# EAGLE board Mixed_signal_board (EAGLE 9.6.2), part 1 of 2
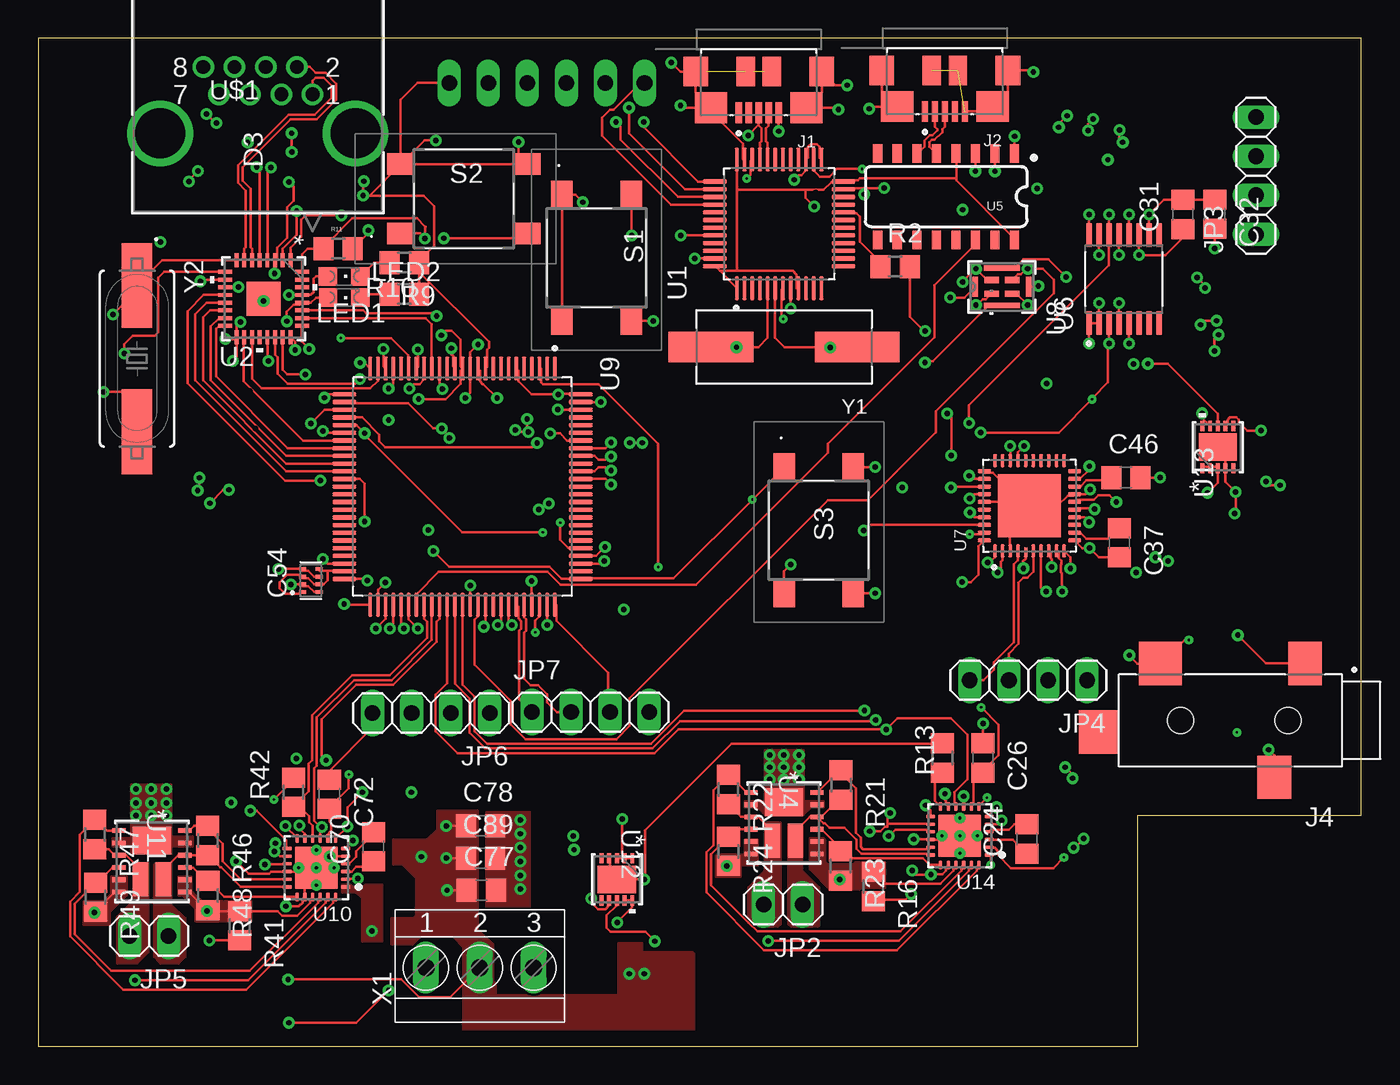
[diagram p7: board, top side]
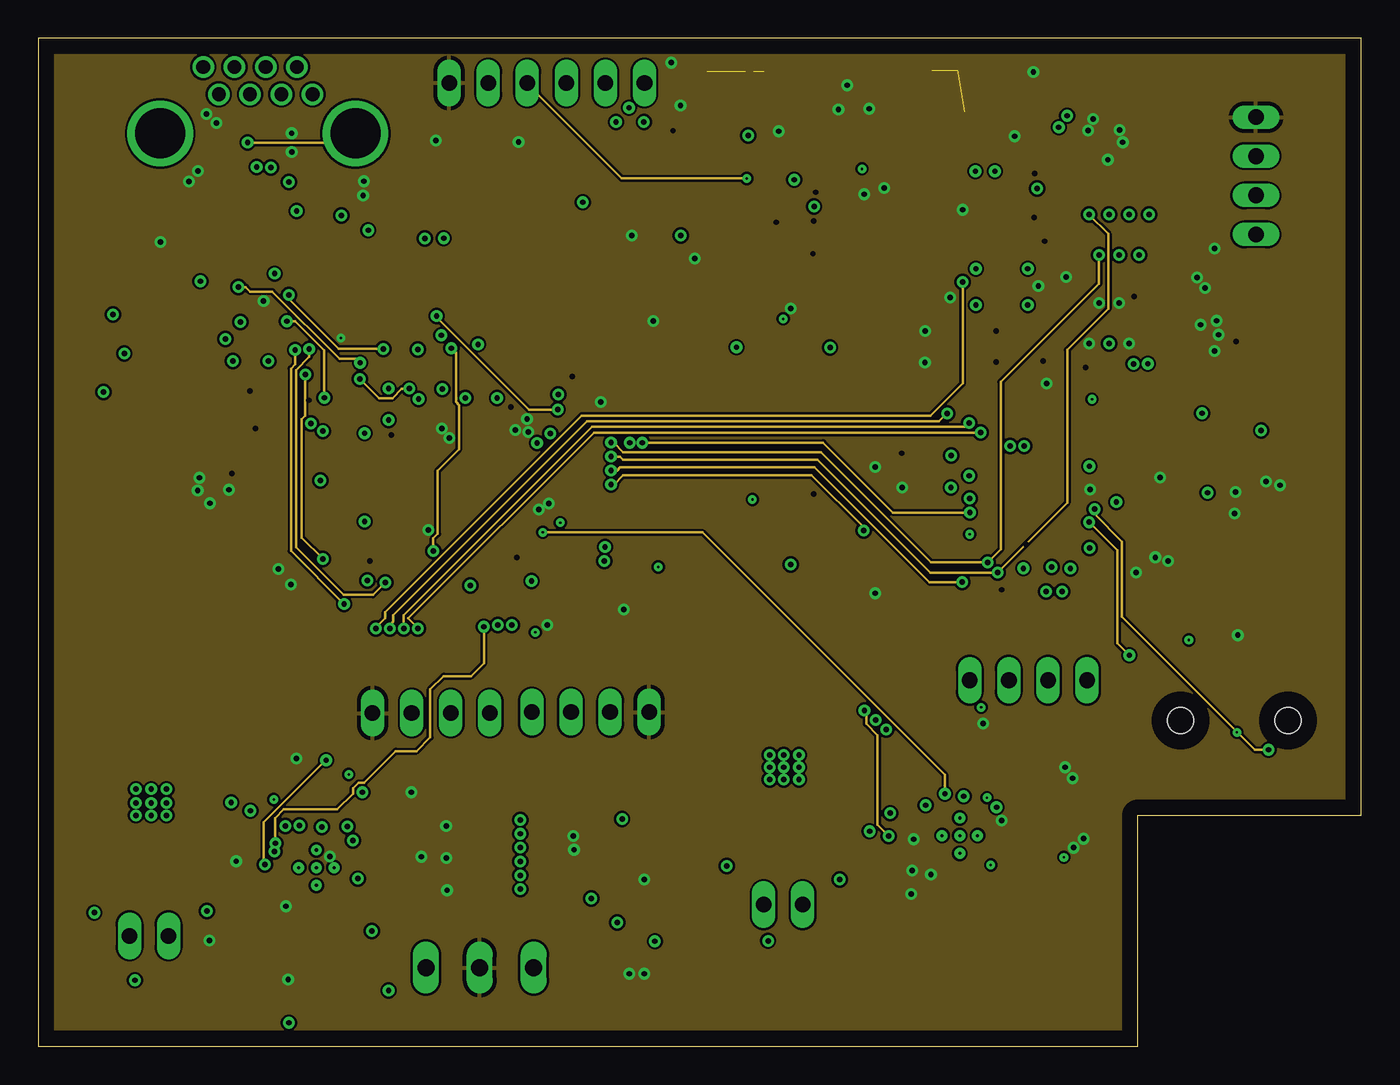
[diagram p8: board, inner layer Route2]
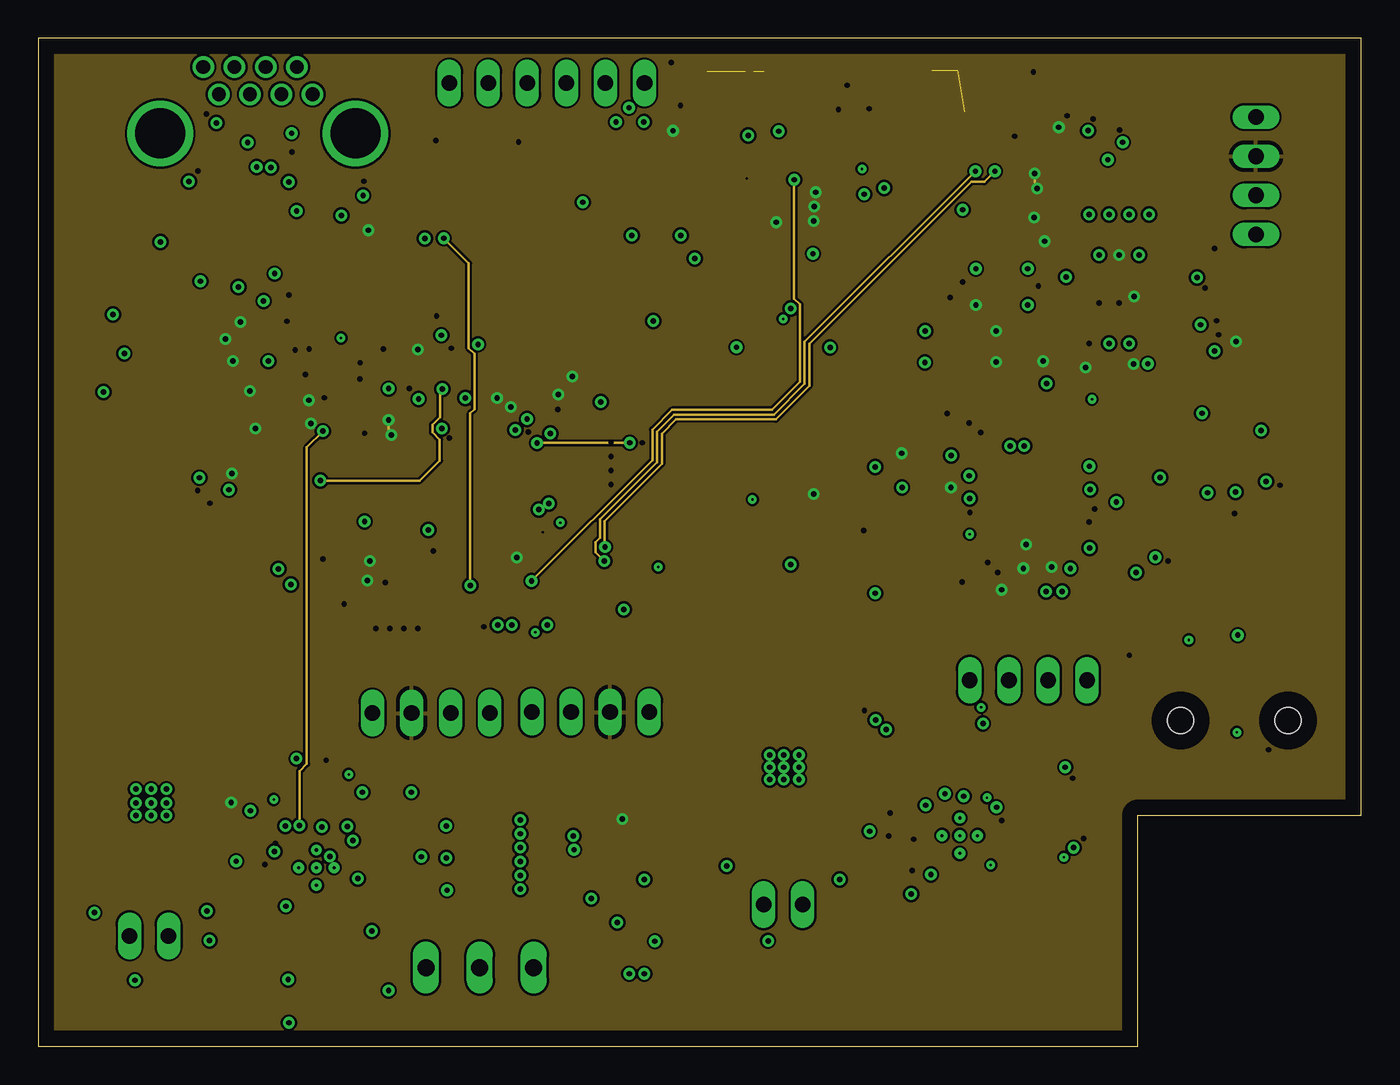
[diagram p9: board, inner layer Route15]
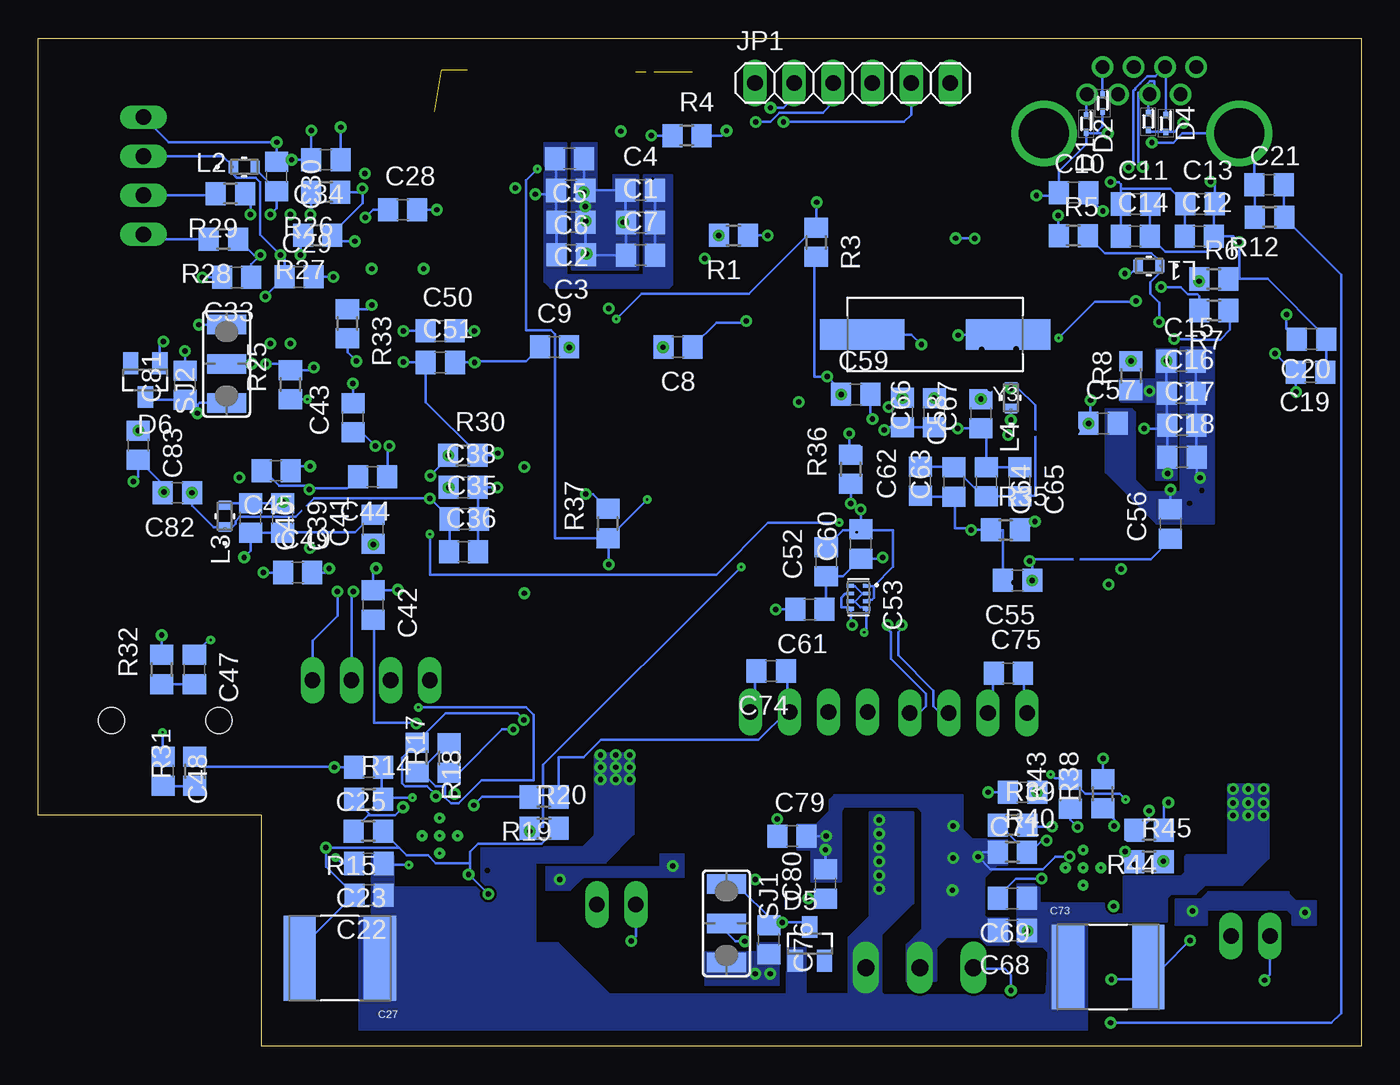
[diagram p10: board, bottom side, seen from below]

Size 86 x 65.5 mm. Coordinates in mm from the lower left corner, seen from the top.
Outline: 71.5,0 71.5,15 86,15 86,65.5 0,65.5 0,0 71.5,0
Copper layers ([2:[15:1+2*15+16]:15]): Top 0.035mm / dielectric 0.2mm / Route2 0.0175mm / dielectric 1.065mm / Route15 0.0175mm / dielectric 0.2mm / Bottom 0.035mm
Design rules "default *": minimum track width 6mil, minimum drill 0.008890625mm, track to track 6mil, track to pad 6mil, pad to pad 6mil, via to via 6mil, smd to smd 0.015240625mm, copper to edge 40mil, drill to drill 6mil, minimum pad ring 10mil, minimum via ring 8mil, stop-mask expansion 4mil, vias tented up to drill 0mil, thermal gap 10mil
Net classes: 1 50ohm: width 0.015 mm, drill 0.015 mm, clearance 0.127 mm

## Footprints (pad centres in the part's own frame; a part is rotated, then mirrored left to right if it is on the bottom)
C0805 = smd 1.3 x 1.5: 1 -0.95,0; 2 0.95,0
CAPC6153X670N = smd 2.09 x 5.52: 1 -2.607,0; 2 2.607,0
CAP_LLA219C70G225MA01L = smd 0.25 x 0.475: 1 -0.75,0.537; 2 -0.25,0.537; 3 0.25,0.537; 4 0.75,0.537; 5 0.75,-0.537; 6 0.25,-0.537; 7 -0.25,-0.537; 8 -0.75,-0.537
SODFL1006X43N = smd 0.43 x 0.32: 1 -0.55,0; 2 0.55,0
SOT23 = smd 1 x 1.4: 1 -0.95,-1.1; 2 0.95,-1.1; 3 0,1.1
HRS_ZX62R-B-5P(30) = smd 0.4 x 1.35: 1 1.3,2.675; 2 0.65,2.675; 3 0,2.675; 4 -0.65,2.675; 5 -1.3,2.675 | smd 2.1 x 2: S1 -3.1,2.35; S2 3.1,2.35 | smd 1.6 x 1.9: S3 4.1,0; S6 -4.1,0 | smd 1.2 x 1.9: S4 0.85,0; S5 -0.85,0
CUI_SJ-3524-SMT = smd 2.2 x 2.8: 1 -1.1,-3.7; 3 0.9,3.7 | smd 2.8 x 2.8: 2 8.3,-3.7 | smd 2.6 x 2.8: 4 12.3,0.75 | hole 1.7: 0,0; 7,0
1X06 = drill 1.016 long: 1 -6.35,0; 2 -3.81,0; 3 -1.27,0; 4 1.27,0; 5 3.81,0; 6 6.35,0
1X02 = drill 1.016 long: 1 -1.27,0; 2 1.27,0
1X04 = drill 1.016 long: 1 -3.81,0; 2 -1.27,0; 3 1.27,0; 4 3.81,0
IND_MPZ1608_TDK = smd 0.597 x 0.813: 1 -0.705,0; 2 0.705,0
CHIPLED_0805 = smd 1.2 x 1.2: A 0,-1.05; C 0,1.05
R0805 = smd 1.3 x 1.5: 1 -0.95,0; 2 0.95,0
TL3145AF180QJ = smd 1.8 x 1.4: 1 -4.1,-2.25; 2 4.1,-2.25; 3 -4.1,2.25; 4 4.1,2.25
SJ_2W = smd 1.27 x 2.54: 1 -2.54,0; 2 0,0; 3 2.54,0
QFP50P900X900X160-48N = smd 1.56 x 0.28: 1 -4.18,2.75; 2 -4.18,2.25; 3 -4.18,1.75; 4 -4.18,1.25; 5 -4.18,0.75; 6 -4.18,0.25; 7 -4.18,-0.25; 8 -4.18,-0.75; 9 -4.18,-1.25; 10 -4.18,-1.75; 11 -4.18,-2.25; 12 -4.18,-2.75; 25 4.18,-2.75; 26 4.18,-2.25; 27 4.18,-1.75; 28 4.18,-1.25; 29 4.18,-0.75; 30 4.18,-0.25; 31 4.18,0.25; 32 4.18,0.75; 33 4.18,1.25; 34 4.18,1.75; 35 4.18,2.25; 36 4.18,2.75 | smd 0.28 x 1.56: 13 -2.75,-4.18; 14 -2.25,-4.18; 15 -1.75,-4.18; 16 -1.25,-4.18; 17 -0.75,-4.18; 18 -0.25,-4.18; 19 0.25,-4.18; 20 0.75,-4.18; 21 1.25,-4.18; 22 1.75,-4.18; 23 2.25,-4.18; 24 2.75,-4.18; 37 2.75,4.18; 38 2.25,4.18; 39 1.75,4.18; 40 1.25,4.18; 41 0.75,4.18; 42 0.25,4.18; 43 -0.25,4.18; 44 -0.75,4.18; 45 -1.25,4.18; 46 -1.75,4.18; 47 -2.25,4.18; 48 -2.75,4.18
VQFN32_RHB_TEX-M = smd 0.908 x 0.255: 1 -2.499,1.75; 2 -2.499,1.25; 3 -2.499,0.75; 4 -2.499,0.25; 5 -2.499,-0.25; 6 -2.499,-0.75; 7 -2.499,-1.25; 8 -2.499,-1.75; 17 2.499,-1.75; 18 2.499,-1.25; 19 2.499,-0.75; 20 2.499,-0.25; 21 2.499,0.25; 22 2.499,0.75; 23 2.499,1.25; 24 2.499,1.75 | smd 0.255 x 0.908: 9 -1.75,-2.499; 10 -1.25,-2.499; 11 -0.75,-2.499; 12 -0.25,-2.499; 13 0.25,-2.499; 14 0.75,-2.499; 15 1.25,-2.499; 16 1.75,-2.499; 25 1.75,2.499; 26 1.25,2.499; 27 0.75,2.499; 28 0.25,2.499; 29 -0.25,2.499; 30 -0.75,2.499; 31 -1.25,2.499; 32 -1.75,2.499 | smd 2.21 x 2.21: 33 0,0
QFN_LFJ-13_DIO = smd 0.305 x 0.864: 1 -2,2.146; 2 -1.2,2.146; 3 -0.4,2.146; 4 0.4,2.146; 5 1.2,2.146; 6 2,2.146; 7 2,-2.146; 8 1.2,-2.146; 9 0.4,-2.146; 10 -0.4,-2.146; 11 -1.2,-2.146; 12 -2,-2.146 | smd 2.21 x 1: 13 1.151,-0.75; 15 1.151,0.75 | smd 1.803 x 2.5: 14 -1.355,0
SO016 = smd 0.6 x 1.2: 1 -4.445,-2.8; 2 -3.175,-2.8; 3 -1.905,-2.8; 4 -0.635,-2.8; 5 0.635,-2.8; 6 1.905,-2.8; 7 3.175,-2.8; 8 4.445,-2.8; 9 4.445,2.8; 10 3.175,2.8; 11 1.905,2.8; 12 0.635,2.8; 13 -0.635,2.8; 14 -1.905,2.8; 15 -3.175,2.8; 16 -4.445,2.8
SOP65P640X120-16N = smd 1.57 x 0.41: 1 -2.87,2.275; 2 -2.87,1.625; 3 -2.87,0.975; 4 -2.87,0.325; 5 -2.87,-0.325; 6 -2.87,-0.975; 7 -2.87,-1.625; 8 -2.87,-2.275; 9 2.87,-2.275; 10 2.87,-1.625; 11 2.87,-0.975; 12 2.87,-0.325; 13 2.87,0.325; 14 2.87,0.975; 15 2.87,1.625; 16 2.87,2.275
QFN50P600X600X100-41N = smd 0.84 x 0.25: 1 -2.935,2.25; 2 -2.935,1.75; 3 -2.935,1.25; 4 -2.935,0.75; 5 -2.935,0.25; 6 -2.935,-0.25; 7 -2.935,-0.75; 8 -2.935,-1.25; 9 -2.935,-1.75; 10 -2.935,-2.25; 21 2.935,-2.25; 22 2.935,-1.75; 23 2.935,-1.25; 24 2.935,-0.75; 25 2.935,-0.25; 26 2.935,0.25; 27 2.935,0.75; 28 2.935,1.25; 29 2.935,1.75; 30 2.935,2.25 | smd 0.25 x 0.84: 11 -2.25,-2.935; 12 -1.75,-2.935; 13 -1.25,-2.935; 14 -0.75,-2.935; 15 -0.25,-2.935; 16 0.25,-2.935; 17 0.75,-2.935; 18 1.25,-2.935; 19 1.75,-2.935; 20 2.25,-2.935; 31 2.25,2.935; 32 1.75,2.935; 33 1.25,2.935; 34 0.75,2.935; 35 0.25,2.935; 36 -0.25,2.935; 37 -0.75,2.935; 38 -1.25,2.935; 39 -1.75,2.935; 40 -2.25,2.935 | smd 4.1 x 4.1: 41 0,0
HCLGA_3X4X1_STM = smd 0.406 x 0.94: 1 -0.451,0.676; 2 -0.451,-0.676; 3 0.451,-0.676; 4 0.451,0.676 | smd 1.295 x 0.356: 5 0,1.727; 6 0,-1.727 | smd 0.356 x 2.311: 7 -1.226,0; 8 1.226,0
QFP50P1600X1600X160-100N = smd 1.56 x 0.28: 1 -7.68,6; 2 -7.68,5.5; 3 -7.68,5; 4 -7.68,4.5; 5 -7.68,4; 6 -7.68,3.5; 7 -7.68,3; 8 -7.68,2.5; 9 -7.68,2; 10 -7.68,1.5; 11 -7.68,1; 12 -7.68,0.5; 13 -7.68,0; 14 -7.68,-0.5; 15 -7.68,-1; 16 -7.68,-1.5; 17 -7.68,-2; 18 -7.68,-2.5; 19 -7.68,-3; 20 -7.68,-3.5; 21 -7.68,-4; 22 -7.68,-4.5; 23 -7.68,-5; 24 -7.68,-5.5; 25 -7.68,-6; 51 7.68,-6; 52 7.68,-5.5; 53 7.68,-5; 54 7.68,-4.5; 55 7.68,-4; 56 7.68,-3.5; 57 7.68,-3; 58 7.68,-2.5; 59 7.68,-2; 60 7.68,-1.5; 61 7.68,-1; 62 7.68,-0.5; 63 7.68,0; 64 7.68,0.5; 65 7.68,1; 66 7.68,1.5; 67 7.68,2; 68 7.68,2.5; 69 7.68,3; 70 7.68,3.5; 71 7.68,4; 72 7.68,4.5; 73 7.68,5; 74 7.68,5.5; 75 7.68,6 | smd 0.28 x 1.56: 26 -6,-7.68; 27 -5.5,-7.68; 28 -5,-7.68; 29 -4.5,-7.68; 30 -4,-7.68; 31 -3.5,-7.68; 32 -3,-7.68; 33 -2.5,-7.68; 34 -2,-7.68; 35 -1.5,-7.68; 36 -1,-7.68; 37 -0.5,-7.68; 38 0,-7.68; 39 0.5,-7.68; 40 1,-7.68; 41 1.5,-7.68; 42 2,-7.68; 43 2.5,-7.68; 44 3,-7.68; 45 3.5,-7.68; 46 4,-7.68; 47 4.5,-7.68; 48 5,-7.68; 49 5.5,-7.68; 50 6,-7.68; 76 6,7.68; 77 5.5,7.68; 78 5,7.68; 79 4.5,7.68; 80 4,7.68; 81 3.5,7.68; 82 3,7.68; 83 2.5,7.68; 84 2,7.68; 85 1.5,7.68; 86 1,7.68; 87 0.5,7.68; 88 0,7.68; 89 -0.5,7.68; 90 -1,7.68; 91 -1.5,7.68; 92 -2,7.68; 93 -2.5,7.68; 94 -3,7.68; 95 -3.5,7.68; 96 -4,7.68; 97 -4.5,7.68; 98 -5,7.68; 99 -5.5,7.68; 100 -6,7.68
TEXAS_INSTRUMENTS_DRV8701ERGER_0 = smd 0.6 x 0.24: 1 -1.9,1.25; 2 -1.9,0.75; 3 -1.9,0.25; 4 -1.9,-0.25; 5 -1.9,-0.75; 6 -1.9,-1.25; 13 1.9,-1.25; 14 1.9,-0.75; 15 1.9,-0.25; 16 1.9,0.25; 17 1.9,0.75; 18 1.9,1.25 | smd 0.24 x 0.6: 7 -1.25,-1.9; 8 -0.75,-1.9; 9 -0.25,-1.9; 10 0.25,-1.9; 11 0.75,-1.9; 12 1.25,-1.9; 19 1.25,1.9; 20 0.75,1.9; 21 0.25,1.9; 22 -0.25,1.9; 23 -0.75,1.9; 24 -1.25,1.9 | smd 2.8 x 2.8: 25 0,0 | drill 0.2 pad 0.5: PAD_1 0,-1.15; PAD_2 0,0; PAD_3 0,1.15; PAD_4 -1.15,0; PAD_5 1.15,0 | smd 1.23 x 1.23: SMD_26 -0.715,0.715; SMD_27 0.715,0.715; SMD_28 -0.715,-0.715; SMD_29 0.715,-0.715
DFN10_3X3_ONS-L = smd 0.657 x 0.255: 1 -1.37,1; 2 -1.37,0.5; 3 -1.37,0; 4 -1.37,-0.5; 5 -1.37,-1; 6 1.37,-1; 7 1.37,-0.5; 8 1.37,0; 9 1.37,0.5; 10 1.37,1 | smd 1.803 x 2.489: 11 0,0
CONN_RJSBE5080_16P13X12P57_AMP = drill 0.889 pad 1.397: 1 0,0; 2 -1.016,1.778; 3 -2.032,0; 4 -3.048,1.778; 5 -4.064,0; 6 -5.08,1.778; 7 -6.096,0; 8 -7.112,1.778 | drill 3.251 pad 3.759: 9 -9.906,-2.54; 10 2.794,-2.54
TERMINAL-BLOCK-3-PIN-3.5MM-LONG-PAD = drill 1.1 pad 1.7 long: 1 -3.5,-0.1; 2 0,-0.1; 3 3.5,-0.1
XTAL_ECS-80-32-5PX-TR = smd 5.5 x 2: 1 -4.75,0; 2 4.75,0
XTAL1170X500X450 = smd 5.5 x 2: 1 -4.75,0; 2 4.75,0

## Placement (x,y rotation side)
C1  0.1uF  [C0805]  46.86,53.54 0 bottom
C2  10nF  [C0805]  51.37,53.55 180 bottom
C3  1uF  [C0805]  51.35,51.43 180 bottom
C4  0.1uF  [C0805]  46.86,55.65 0 bottom
C5  0.1uF  [C0805]  51.46,57.69 180 bottom
C6  0.1uF  [C0805]  51.38,55.62 180 bottom
C7  4.7uF  [C0805]  46.85,51.42 0 bottom
C8  32pF  [C0805]  44.41,45.45 180 bottom
C9  32pF  [C0805]  52.45,45.45 0 bottom
C10  2nF  [C0805]  18.69,55.48 0 bottom
C11  10uF  [C0805]  14.66,54.74 0 bottom
C12  1uF  [C0805]  10.52,52.64 0 bottom
C13  0.1uF  [C0805]  10.47,54.75 0 bottom
C14  10nF  [C0805]  14.68,52.64 0 bottom
C15  10uF  [C0805]  11.7,44.53 0 bottom
C16  1uF  [C0805]  11.68,42.43 0 bottom
C17  0.1uF  [C0805]  11.65,40.37 0 bottom
C18  10nF  [C0805]  11.64,38.28 0 bottom
C19  20pF  [C0805]  3.28,43.81 180 bottom
C20  20pF  [C0805]  3.21,45.96 180 bottom
C21  10nF  [C0805]  5.98,55.99 0 bottom
C22  0.1uF  [C0805]  64.5,9.82 180 bottom
C23  1uF  [C0805]  64.52,11.87 180 bottom
C24  0.1uF  [C0805]  64.27,13.46 90 top
C25  1uF  [C0805]  64.54,18.13 180 bottom
C26  1uF  [C0805]  61.42,18.73 270 top
C27  KCM55WC71E107MH13L  [CAPC6153X670N]  66.41,5.73 180 bottom
C28  0.1uF  [C0805]  62.32,54.37 0 bottom
C29  0.1uF  [C0805]  69.05,50 0 bottom
C30  0.1uF  [C0805]  70.51,56.52 270 bottom
C31  0.1uF  [C0805]  74.41,54.06 90 top
C32  10nF  [C0805]  76.48,54.08 270 top
C33  10nF  [C0805]  73.11,49.97 180 bottom
C34  0.1uF  [C0805]  67.31,57.62 180 bottom
C35  0.1uF  [C0805]  58.31,34.26 0 bottom
C36  1uF  [C0805]  58.36,32.13 0 bottom
C37  1uF  [C0805]  70.28,32.72 270 top
C38  0.1uF  [C0805]  58.38,36.32 0 bottom
C39  0.1uF  [C0805]  70.12,34.33 270 bottom
C40  1uF  [C0805]  72.21,34.34 270 bottom
C41  0.1uF  [C0805]  64.24,33.6 90 bottom
C42  1uF  [C0805]  64.24,28.67 270 bottom
C43  150pF  [C0805]  65.55,40.85 90 bottom
C44  150pF  [C0805]  64.27,37.01 180 bottom
C45  1uF  [C0805]  70.55,37.4 180 bottom
C46  10uF  [C0805]  70.71,36.96 0 top
C47  22nF  [C0805]  75.86,24.48 270 bottom
C48  22nF  [C0805]  77.89,17.87 270 bottom
C49  1nF  [C0805]  69.14,30.79 0 bottom
C50  0.1uF  [C0805]  59.89,46.49 0 bottom
C51  1uF  [C0805]  59.87,44.44 0 bottom
C52  0.1uF  [C0805]  34.78,31.49 90 bottom
C53  LLA219C70G225MA01L  [CAP_LLA219C70G225MA01L]  32.68,29.18 270 bottom
C54  LLA219C70G225MA01L  [CAP_LLA219C70G225MA01L]  17.71,30.27 90 top
C55  0.1uF  [C0805]  22.33,30.27 180 bottom
C56  0.1uF  [C0805]  12.39,33.93 90 bottom
C57  0.1uF  [C0805]  16.77,40.48 0 bottom
C58  0.1uF  [C0805]  29.82,41.19 270 bottom
C59  0.1uF  [C0805]  32.86,42.36 0 bottom
C60  0.1uF  [C0805]  32.53,32.65 90 bottom
C61  4.7uF  [C0805]  35.83,28.39 180 bottom
C62  0.1uF  [C0805]  28.66,36.71 90 bottom
C63  0.1uF  [C0805]  26.47,36.67 90 bottom
C64  1uF  [C0805]  24.36,36.69 270 bottom
C65  1uF  [C0805]  22.19,36.69 270 bottom
C66  32pF  [C0805]  27.75,41.18 90 bottom
C67  32pF  [C0805]  24.72,41.11 90 bottom
C68  0.1uF  [C0805]  22.67,7.52 180 bottom
C69  1uF  [C0805]  22.67,9.6 180 bottom
C70  0.1uF  [C0805]  21.78,12.96 90 top
C71  1uF  [C0805]  22.01,16.5 180 bottom
C72  1uF  [C0805]  18.92,16.38 270 top
C73  KCM55WC71E107MH13L  [CAPC6153X670N]  16.44,5.14 0 bottom
C74  0.1uF  [C0805]  38.36,24.38 180 bottom
C75  0.1uF  [C0805]  22.94,24.24 0 bottom
C76  1uF  [C0805]  38.51,6.92 270 bottom
C77  100uF  [C0805]  28.8,10.14 0 top
C78  100uF  [C0805]  28.74,14.32 0 top
C79  1uF  [C0805]  37,13.65 0 bottom
C80  10nF  [C0805]  34.83,10.54 90 bottom
C81  1uF  [C0805]  76.47,42.96 90 bottom
C82  1uF  [C0805]  76.96,35.97 180 bottom
C83  10nF  [C0805]  79.51,39.06 270 bottom
C89  100uF  [C0805]  28.74,12.22 0 top
D1  ESD3V3D9-TP  [SODFL1006X43N]  17.88,59.95 270 bottom
D2  ESD3V3D9-TP  [SODFL1006X43N]  16.81,61.29 270 bottom
D3  ESD3V3D9-TP  [SODFL1006X43N]  13.84,60.1 270 bottom
D4  ESD3V3D9-TP  [SODFL1006X43N]  12.7,59.98 270 bottom
D5  BAS40  [SOT23]  35.84,6.65 0 bottom
D6  BAS40  [SOT23]  79.05,43.29 180 bottom
J1  ZX62R-B-5P(30)  [HRS_ZX62R-B-5P(30)]  46.83,63.35 180 top
J2  ZX62R-B-5P(30)  [HRS_ZX62R-B-5P(30)]  58.94,63.42 180 top
J4  SJ-3524-SMT  [CUI_SJ-3524-SMT]  81.26,21.17 180 top
JP1  [1X06]  33.06,62.61 0 bottom
JP2  [1X02]  48.42,9.21 180 top
JP3  [1X04]  79.17,56.58 90 top
JP4  [1X04]  64.37,23.78 180 top
JP5  [1X02]  7.19,7.16 180 top
JP6  [1X04]  25.53,21.65 180 top
JP7  [1X04]  35.9,21.71 0 top
L1  MPZ1608B471AT  [IND_MPZ1608_TDK]  13.79,50.72 180 bottom
L2  MPZ1608B471AT  [IND_MPZ1608_TDK]  72.62,57.15 0 bottom
L3  MPZ1608B471AT  [IND_MPZ1608_TDK]  73.88,34.45 90 bottom
L4  MPZ1608B471AT  [IND_MPZ1608_TDK]  22.77,42.15 90 bottom
LED1  [CHIPLED_0805]  19.89,48.66 270 top
LED2  [CHIPLED_0805]  19.88,50.03 270 top
R1  100k  [R0805]  40.81,52.7 180 bottom
R2  100k  [R0805]  55.7,50.67 0 top
R3  10k  [R0805]  35.43,52.25 270 bottom
R4  1.5k  [R0805]  43.83,59.18 0 bottom
R5  10k  [R0805]  18.71,52.68 0 bottom
R6  6.49k  [R0805]  9.58,49.87 0 bottom
R7  10k  [R0805]  9.57,47.82 180 bottom
R8  10k  [R0805]  14.96,43.57 90 bottom
R9  1k  [R0805]  23.8,48.88 180 top
R10  1k  [R0805]  23.79,50.93 180 top
R11  10k  [R0805]  19.49,51.84 180 top
R12  1M  [R0805]  5.95,53.88 180 bottom
R13  33k  [R0805]  58.78,18.74 90 top
R14  2k  [R0805]  64.52,16.05 0 bottom
R15  3.3k  [R0805]  64.54,13.97 180 bottom
R16  50m  [R0805]  54.29,10.37 270 top
R17  10k  [R0805]  59.31,18.74 90 bottom
R18  10k  [R0805]  61.39,18.77 270 bottom
R19  10k  [R0805]  53.13,16.2 180 bottom
R20  10k  [R0805]  53.13,14.15 0 bottom
R21  10k  [R0805]  52.19,16.98 270 top
R22  10k  [R0805]  44.87,16.68 270 top
R23  10k  [R0805]  52.15,11.72 270 top
R24  10k  [R0805]  44.87,12.66 270 top
R25  10k  [R0805]  69.62,43 90 bottom
R26  10k  [R0805]  67.32,55.51 180 bottom
R27  10k  [R0805]  67.85,52.71 180 bottom
R28  1k  [R0805]  73.97,52.45 180 bottom
R29  1k  [R0805]  73.52,55.41 180 bottom
R30  10k  [R0805]  58.41,38.4 0 bottom
R31  51.1  [R0805]  75.83,17.87 90 bottom
R32  51.1  [R0805]  77.99,24.48 90 bottom
R33  10k  [R0805]  65.91,46.96 270 bottom
R35  100k  [R0805]  23.12,33.56 0 bottom
R36  100k  [R0805]  33.18,37.5 90 bottom
R37  10k  [R0805]  48.97,33.97 90 bottom
R38  33k  [R0805]  16.8,16.41 90 bottom
R39  2k  [R0805]  22.65,14.36 0 bottom
R40  3.3k  [R0805]  22.67,12.61 0 bottom
R41  50m  [R0805]  13.08,7.82 270 top
R42  10k  [R0805]  16.58,16.51 90 top
R43  10k  [R0805]  18.91,16.38 90 bottom
R44  10k  [R0805]  13.79,14.04 180 bottom
R45  10k  [R0805]  13.78,12 0 bottom
R46  10k  [R0805]  11.01,13.37 270 top
R47  10k  [R0805]  3.67,13.76 270 top
R48  10k  [R0805]  11.02,9.79 270 top
R49  10k  [R0805]  3.72,9.68 270 top
S1  TL3145AF180QJ  [TL3145AF180QJ]  36.29,51.24 270 top
S2  TL3145AF180QJ  [TL3145AF180QJ]  27.66,55.08 0 top
S3  TL3145AF180QJ  [TL3145AF180QJ]  50.74,33.54 270 top
SJ1  [SJ_2W]  41.27,7.99 270 bottom
SJ2  [SJ_2W]  73.77,44.35 90 bottom
U1  STM32F103CBT6  [QFP50P900X900X160-48N]  48.16,53.45 90 top
U2  DP83826IRHBRVQFN32_RHB_TEX-M  [VQFN32_RHB_TEX-M]  14.64,48.58 270 top
U4  DMHT6016LFJ-13  [QFN_LFJ-13_DIO]  48.48,14.5 270 top
U5  CH340C  [SO016]  59.02,55.21 180 top
U6  ADS122C04IPWR  [SOP65P640X120-16N]  70.59,49.86 90 top
U7  CS43L22-CNZ  [QFN50P600X600X100-41N]  64.44,35.13 90 top
U8  IMP34DT05TR  [HCLGA_3X4X1_STM]  62.65,49.35 90 top
U9  STM32F407VGT6  [QFP50P1600X1600X160-100N]  27.58,36.37 270 top
U10  TEXAS_INSTRUMENTS_DRV8701ERGERTEXAS_INSTRUMENTS_DRV8701ERGER_0_0  [TEXAS_INSTRUMENTS_DRV8701ERGER_0]  18.07,11.6 180 top
U11  DMHT6016LFJ-13  [QFN_LFJ-13_DIO]  7.39,12.01 270 top
U12  NCV8535MN330R2GDFN10_3X3_ONS-L  [DFN10_3X3_ONS-L]  37.61,10.84 270 top
U13  NCV8535MN180R2GDFN10_3X3_ONS-L  [DFN10_3X3_ONS-L]  76.68,38.94 90 top
U14  TEXAS_INSTRUMENTS_DRV8701ERGERTEXAS_INSTRUMENTS_DRV8701ERGER_0_0  [TEXAS_INSTRUMENTS_DRV8701ERGER_0]  59.91,13.68 180 top
U$1  RJ-45  [CONN_RJSBE5080_16P13X12P57_AMP]  17.82,61.87 0 top
X1  TERMINAL-BLOCK-3.5MM-3-PIN-LONG-PAD  [TERMINAL-BLOCK-3-PIN-3.5MM-LONG-PAD]  28.69,5.2 0 top
Y1  ECS-80-32-5PX-TR  [XTAL_ECS-80-32-5PX-TR]  48.48,45.44 180 top
Y2  FOXSDLF/250F-20  [XTAL1170X500X450]  6.41,44.69 270 top
Y3  ECS-80-32-5PX-TR  [XTAL_ECS-80-32-5PX-TR]  27.7,46.25 180 bottom